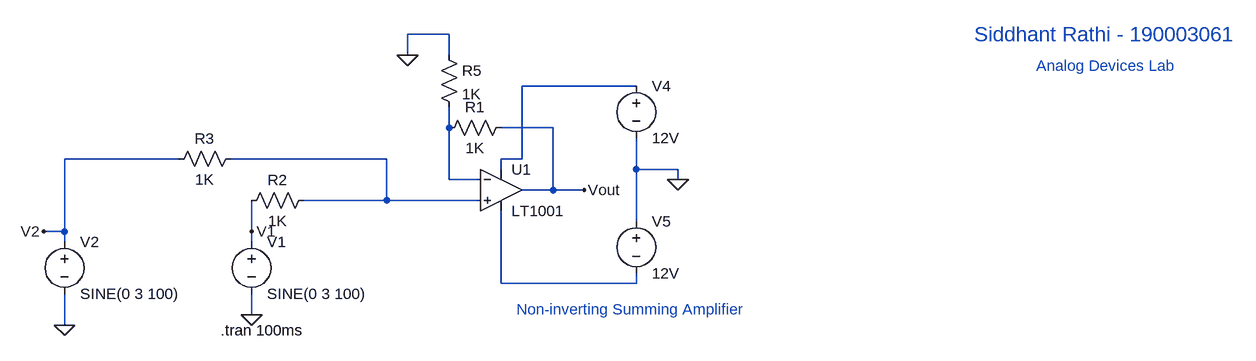
[diagram p0: schematic noninvertingSummer.asc]
noninvertingSummer.asc, the LTspice schematic file:
Version 4
SHEET 1 1240 680
WIRE -32 -64 -96 -64
WIRE -96 -32 -96 -64
WIRE -32 -32 -32 -64
WIRE 256 16 80 16
WIRE -32 80 -32 48
WIRE 128 80 48 80
WIRE -448 128 -624 128
WIRE -128 128 -368 128
WIRE 80 128 80 16
WIRE 80 128 48 128
WIRE 48 144 48 128
WIRE 256 144 256 96
WIRE 320 144 256 144
WIRE -32 160 -32 80
WIRE 16 160 -32 160
WIRE 320 160 320 144
WIRE 128 176 128 80
WIRE 128 176 80 176
WIRE 176 176 128 176
WIRE -128 192 -128 128
WIRE -128 192 -256 192
WIRE 16 192 -128 192
WIRE 256 224 256 144
WIRE -624 240 -624 128
WIRE -624 240 -656 240
WIRE -336 240 -336 192
WIRE -624 256 -624 240
WIRE -336 256 -336 240
WIRE 48 320 48 208
WIRE 256 320 256 304
WIRE 256 320 48 320
WIRE -336 368 -336 336
WIRE -624 384 -624 336
FLAG -336 368 0
FLAG -336 240 V1
FLAG 176 176 Vout
FLAG 320 160 0
FLAG -624 384 0
FLAG -656 240 V2
FLAG -96 -32 0
SYMBOL OpAmps\\LT1001 48 112 R0
SYMATTR InstName U1
SYMBOL res 64 64 R90
WINDOW 0 0 56 VBottom 2
WINDOW 3 32 56 VTop 2
SYMATTR InstName R1
SYMATTR Value 1K
SYMBOL res -240 176 R90
WINDOW 0 0 56 VBottom 2
WINDOW 3 32 56 VTop 2
SYMATTR InstName R2
SYMATTR Value 1K
SYMBOL voltage -336 240 R0
WINDOW 123 0 0 Left 0
WINDOW 39 0 0 Left 0
SYMATTR InstName V1
SYMATTR Value SINE(0 3 100)
SYMBOL voltage 256 0 R0
WINDOW 123 0 0 Left 0
WINDOW 39 0 0 Left 0
SYMATTR InstName V4
SYMATTR Value 12V
SYMBOL voltage 256 208 R0
WINDOW 123 0 0 Left 0
WINDOW 39 0 0 Left 0
SYMATTR InstName V5
SYMATTR Value 12V
SYMBOL res -352 112 R90
WINDOW 0 0 56 VBottom 2
WINDOW 3 32 56 VTop 2
SYMATTR InstName R3
SYMATTR Value 1K
SYMBOL voltage -624 240 R0
WINDOW 123 0 0 Left 0
WINDOW 39 0 0 Left 0
SYMATTR InstName V2
SYMATTR Value SINE(0 3 100)
SYMBOL res -48 -48 R0
SYMATTR InstName R5
SYMATTR Value 1K
TEXT -384 392 Left 2 !.tran 100ms
TEXT 776 -64 Left 3 ;Siddhant Rathi - 190003061
TEXT 872 -16 Left 2 ;Analog Devices Lab
TEXT 72 360 Left 2 ;Non-inverting Summing Amplifier

The netlist it stands for:
* noninvertingSummer.asc
XU1 N003 N002 N001 N004 Vout LT1001  ; pins In+ In- V+ V- OUT
R1 Vout N002 1K
R2 N003 V1 1K
V1 V1 0 SINE(0 3 100)
V4 N001 0 12V
V5 0 N004 12V
R3 N003 V2 1K
V2 V2 0 SINE(0 3 100)
R5 0 N002 1K
.tran 100ms
* Siddhant Rathi - 190003061
* Analog Devices Lab
* Non-inverting Summing Amplifier
.lib LTC.lib
.backanno
.end